# Altium schematic sheet relay.SchDoc
size A4; SheetNumber: 4; SheetTotal: 4
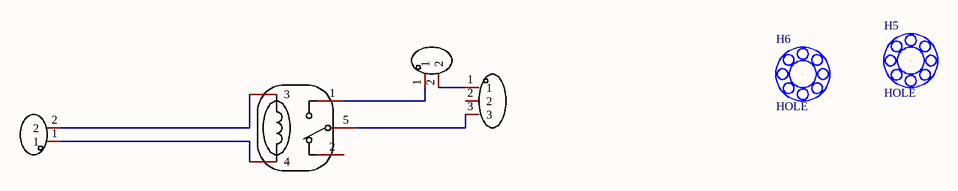
[diagram p0: relay.SchDoc]

## Parts
H5  HOLE  [HOLE_3.5mm_MUL]
H6  HOLE  [HOLE_3.5mm_MUL]
K1  SRA-12VDC-CL  [RELAY-TH_SRA-X-CX]  (value not drawn)
p16  ZX-VH3.96-2PZZ  [CONN-TH_2P-P3.96_MEGASTAR_ZX-VH3.96-2PZZ]  (value not drawn)
p17  ZX-VH3.96-3PZZ  [CONN-TH_3P-P3.96_FWF39601-S03S22W1B]  (value not drawn)
P18  ZX-HY2.0-2PZZ  [CONN-TH_2P-P2.00_ZX-HY2.0-2PZZ]  (value not drawn)

## Nets
NetK1_1: K1.1 p16.1
NetK1_3: K1.3 P18.2
NetK1_4: K1.4 P18.1
NetK1_5: K1.5 p17.3
Netp16_2: p16.2 p17.1

Not connected (* = marked no-connect by the designer): H5 1; H6 1; K1 2; p17 2

## Library data of the parts
H5 H6 = HOLE: 固定孔
K1 = 继电器: 12v; Manufacturer: 松乐; Add into BOM: yes; Contact Form: 一组转换:1C(单刀双掷-转换); Pin Number: 5; Maximum Switching Voltage: 125V@AC; Coil Rated Power: 600mW; Maximum Switching Current: 10A; Coil Type: 无极性-单线圈; Coil Resistance: 240Ω; Contact Resistance: 100mΩ; Operate Time: 10ms; Symbol: SRA-12VDC-CL; Device: SRA-12VDC-CL; LCSC Part Name: 黑色; Supplier Part: C60169; Manufacturer Part: SRA-12VDC-CL; Supplier Footprint: 插件,12.4x16mm; JLCPCB Part Class: Extended Part; Datasheet: https://atta.szlcsc.com/upload/public/pdf/source/20180525/C99666_083B3C24D5AD4D7A00C20E2707DD072C.pdf; Supplier: LCSC; Convert to PCB: yes; Coil Voltage: 12V; Contact Rating: -; Release Time: 10ms; Operating Temperature: -40℃~+85℃
p16 = VH3.96-2PZZ: 2p; Manufacturer: Megastar(兆星); Add into BOM: yes; Pins Structure: 1x2P; Pitch: 3.96mm; Reference Series: VH; Number of PINs Per Row: 2; Current Rating (Max): 3A; Symbol: ZX-VH3.96-2PZZ; Device: ZX-VH3.96-2PZZ; LCSC Part Name: ZX-VH3.96-2PZZ; Supplier Part: C7429660; Manufacturer Part: ZX-VH3.96-2PZZ; Supplier Footprint: 插件,P=3.96mm; JLCPCB Part Class: Extended Part; Datasheet: https://atta.szlcsc.com/upload/public/pdf/source/20230619/B0F65C0388219DF8CB89B38B943D83C5.pdf; Supplier: LCSC; Convert to PCB: yes; Mounting Style: 直插; Number of Pins: 2P; Number of Rows: 1; Row Spacing: -; Contact Material: 黄铜; Contact Plating: 锡; Operating Temperature Range: -25℃~+85℃
p17 = VH3.96-3P ZZ: Manufacturer: SHOU HAN(首韩); Add into BOM: yes; Pins Structure: 1x3P; Pitch: 3.96mm; Reference Series: VH; Number of PINs Per Row: 3; Current Rating (Max): 7A; Symbol: VH3.96-3P ZZ; Device: VH3.96-3P ZZ; LCSC Part Name: 1x3P 间距:3.96mm 直插 系列:VH; Supplier Part: C5379869; Manufacturer Part: VH3.96-3P ZZ; Supplier Footprint: 插件,P=3.96mm; JLCPCB Part Class: Extended Part; Datasheet: https://atta.szlcsc.com/upload/public/pdf/source/20230323/0E3E4D4D36660133C8ECF6E8E2FE008C.pdf; Supplier: LCSC; Convert to PCB: yes; Mounting Style: 直插; Number of Pins: 3P; Number of Rows: 1; Row Spacing: 3.96mm; Contact Material: 黄铜; Contact Plating: 锡; Operating Temperature Range: -25℃~+85℃
P18 = HY2.0-2PZZ: 2p; Manufacturer: Megastar(兆星); Add into BOM: yes; Pins Structure: 1x2P; Pitch: 2mm; Reference Series: HY; Number of PINs Per Row: 2; Current Rating (Max): 2A; Name: ZX-HY2.0-2PZZ; Symbol: ZX-HY2.0-2PZZ; Device: ZX-HY2.0-2PZZ; LCSC Part Name: 1x2P 间距:2mm 直插 系列:HY; Supplier Part: C7429578; Manufacturer Part: ZX-HY2.0-2PZZ; Supplier Footprint: 插件,P=2mm; JLCPCB Part Class: Extended Part; Datasheet: https://atta.szlcsc.com/upload/public/pdf/source/20230619/DEC43A5E9BAFB7A5BDB16FEDBE15E2A0.pdf; Supplier: LCSC; Convert to PCB: yes; Mounting Style: 直插; Number of Pins: 2P; Number of Rows: 1; Row Spacing: -; Contact Material: 黄铜; Contact Plating: 锡; Operating Temperature Range: -25℃~+85℃